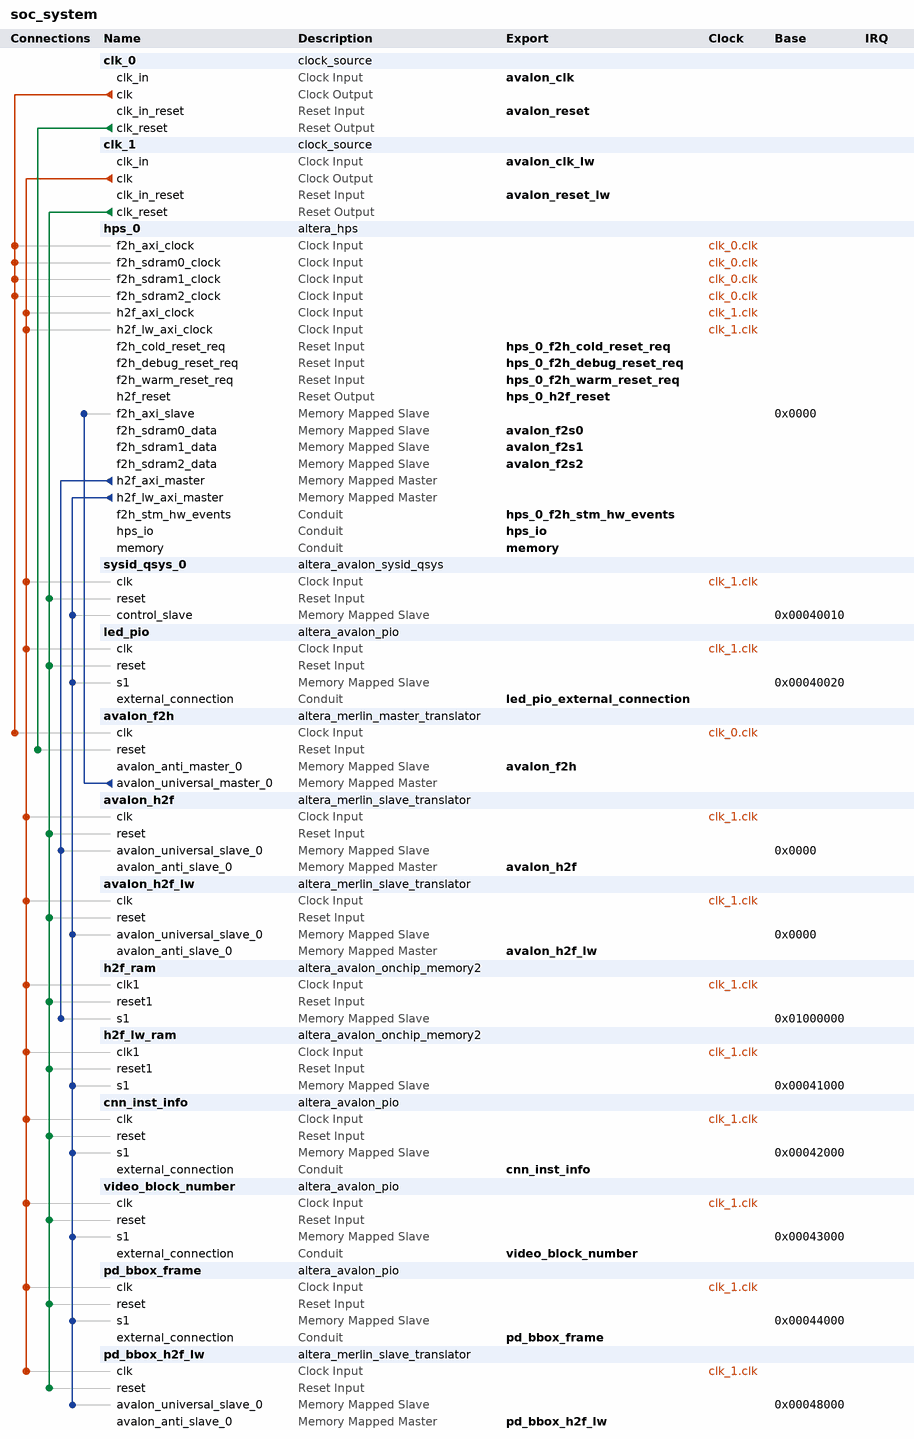
[diagram p0: system contents]
# Platform Designer (Qsys) system soc_system, Cyclone V 5CSEBA6U23I7
# Parameters at their usual value, and those the tool derives, are not listed.
package require -exact qsys 14.0
create_system soc_system
set_project_property DEVICE_FAMILY {Cyclone V}
set_project_property DEVICE 5CSEBA6U23I7

add_instance clk_0 clock_source 14.0
set_instance_parameter_value clk_0 clockFrequency 150000000

add_instance clk_1 clock_source 14.0
set_instance_parameter_value clk_1 clockFrequency 50000000

add_instance hps_0 altera_hps 14.0
set_instance_parameter_value hps_0 MEM_VENDOR Other
set_instance_parameter_value hps_0 MEM_ROW_ADDR_WIDTH 15
set_instance_parameter_value hps_0 MEM_COL_ADDR_WIDTH 10
set_instance_parameter_value hps_0 MEM_DQ_WIDTH 32
set_instance_parameter_value hps_0 MEM_BANKADDR_WIDTH 3
set_instance_parameter_value hps_0 MEM_DRV_STR RZQ/6
set_instance_parameter_value hps_0 MEM_RTT_NOM RZQ/6
set_instance_parameter_value hps_0 MEM_RTT_WR {Dynamic ODT off}
set_instance_parameter_value hps_0 MEM_WTCL 7
set_instance_parameter_value hps_0 MEM_TCL 7
set_instance_parameter_value hps_0 TIMING_TIS 175
set_instance_parameter_value hps_0 TIMING_TIH 250
set_instance_parameter_value hps_0 TIMING_TDS 50
set_instance_parameter_value hps_0 TIMING_TDH 125
set_instance_parameter_value hps_0 TIMING_TDQSQ 120
set_instance_parameter_value hps_0 TIMING_TDQSCK 400
set_instance_parameter_value hps_0 TIMING_TQSH 0.38
set_instance_parameter_value hps_0 MEM_TRAS_NS 35.0
set_instance_parameter_value hps_0 MEM_TRCD_NS 13.75
set_instance_parameter_value hps_0 MEM_TRP_NS 13.75
set_instance_parameter_value hps_0 MEM_TRFC_NS 300.0
set_instance_parameter_value hps_0 MEM_TFAW_NS 37.5
set_instance_parameter_value hps_0 REF_CLK_FREQ 25.0
set_instance_parameter_value hps_0 TIMING_BOARD_MAX_CK_DELAY 0.6
set_instance_parameter_value hps_0 TIMING_BOARD_MAX_DQS_DELAY 0.6
set_instance_parameter_value hps_0 TIMING_BOARD_SKEW_CKDQS_DIMM_MIN -0.01
set_instance_parameter_value hps_0 TIMING_BOARD_SKEW_CKDQS_DIMM_MAX 0.01
set_instance_parameter_value hps_0 TIMING_BOARD_SKEW_WITHIN_DQS 0.02
set_instance_parameter_value hps_0 TIMING_BOARD_SKEW_BETWEEN_DQS 0.02
set_instance_parameter_value hps_0 TIMING_BOARD_DQ_TO_DQS_SKEW 0.0
set_instance_parameter_value hps_0 TIMING_BOARD_AC_SKEW 0.02
set_instance_parameter_value hps_0 TIMING_BOARD_AC_TO_CK_SKEW 0.0
set_instance_parameter_value hps_0 MEM_CLK_FREQ 400.0
set_instance_parameter_value hps_0 HPS_PROTOCOL DDR3
set_instance_parameter_value hps_0 desired_cfg_clk_mhz 100.0
set_instance_parameter_value hps_0 desired_qspi_clk_mhz 400.0
set_instance_parameter_value hps_0 STM_Enable true
set_instance_parameter_value hps_0 F2S_Width 1
set_instance_parameter_value hps_0 S2F_Width 1
set_instance_parameter_value hps_0 LWH2F_Enable true
set_instance_parameter_value hps_0 F2SDRAM_Type {Avalon-MM Bidirectional,Avalon-MM Bidirectional,Avalon-MM Bidirectional}
set_instance_parameter_value hps_0 F2SDRAM_Width 32,32,32
set_instance_parameter_value hps_0 F2SCLK_DBGRST_Enable true
set_instance_parameter_value hps_0 F2SCLK_WARMRST_Enable true
set_instance_parameter_value hps_0 F2SCLK_COLDRST_Enable true
set_instance_parameter_value hps_0 F2SINTERRUPT_Enable false
set_instance_parameter_value hps_0 EMAC1_PinMuxing {HPS I/O Set 0}
set_instance_parameter_value hps_0 EMAC1_Mode RGMII
set_instance_parameter_value hps_0 QSPI_PinMuxing Unused
set_instance_parameter_value hps_0 QSPI_Mode N/A
set_instance_parameter_value hps_0 SDIO_PinMuxing {HPS I/O Set 0}
set_instance_parameter_value hps_0 SDIO_Mode {4-bit Data}
set_instance_parameter_value hps_0 USB1_PinMuxing {HPS I/O Set 0}
set_instance_parameter_value hps_0 USB1_Mode SDR
set_instance_parameter_value hps_0 SPIM1_PinMuxing {HPS I/O Set 0}
set_instance_parameter_value hps_0 SPIM1_Mode {Single Slave Select}
set_instance_parameter_value hps_0 UART0_PinMuxing {HPS I/O Set 0}
set_instance_parameter_value hps_0 UART0_Mode {No Flow Control}
set_instance_parameter_value hps_0 I2C0_PinMuxing {HPS I/O Set 0}
set_instance_parameter_value hps_0 I2C0_Mode I2C
set_instance_parameter_value hps_0 I2C1_PinMuxing {HPS I/O Set 0}
set_instance_parameter_value hps_0 I2C1_Mode I2C
set_instance_parameter_value hps_0 FPGA_PERIPHERAL_OUTPUT_CLOCK_FREQ_EMAC0_MD_CLK 100
set_instance_parameter_value hps_0 FPGA_PERIPHERAL_OUTPUT_CLOCK_FREQ_EMAC0_GTX_CLK 100
set_instance_parameter_value hps_0 FPGA_PERIPHERAL_OUTPUT_CLOCK_FREQ_EMAC1_MD_CLK 100
set_instance_parameter_value hps_0 FPGA_PERIPHERAL_OUTPUT_CLOCK_FREQ_EMAC1_GTX_CLK 100

add_instance sysid_qsys_0 altera_avalon_sysid_qsys 14.0
set_instance_parameter_value sysid_qsys_0 id 305419896

add_instance led_pio altera_avalon_pio 14.0
set_instance_parameter_value led_pio direction Output
set_instance_parameter_value led_pio width 8

add_instance avalon_f2h altera_merlin_master_translator 14.0
set_instance_parameter_value avalon_f2h AV_ADDRESS_W 32
set_instance_parameter_value avalon_f2h AV_DATA_W 32
set_instance_parameter_value avalon_f2h AV_BURSTCOUNT_W 4
set_instance_parameter_value avalon_f2h AV_BYTEENABLE_W 4
set_instance_parameter_value avalon_f2h UAV_ADDRESS_W 32
set_instance_parameter_value avalon_f2h UAV_BURSTCOUNT_W 4
set_instance_parameter_value avalon_f2h AV_READLATENCY 0
set_instance_parameter_value avalon_f2h AV_WRITE_WAIT 0
set_instance_parameter_value avalon_f2h AV_READ_WAIT 0
set_instance_parameter_value avalon_f2h AV_DATA_HOLD 0
set_instance_parameter_value avalon_f2h AV_SETUP_WAIT 0
set_instance_parameter_value avalon_f2h USE_READDATA 1
set_instance_parameter_value avalon_f2h USE_WRITEDATA 1
set_instance_parameter_value avalon_f2h USE_READ 1
set_instance_parameter_value avalon_f2h USE_WRITE 1
set_instance_parameter_value avalon_f2h USE_BEGINBURSTTRANSFER 1
set_instance_parameter_value avalon_f2h USE_BEGINTRANSFER 1
set_instance_parameter_value avalon_f2h USE_BYTEENABLE 1
set_instance_parameter_value avalon_f2h USE_CHIPSELECT 0
set_instance_parameter_value avalon_f2h USE_ADDRESS 1
set_instance_parameter_value avalon_f2h USE_BURSTCOUNT 1
set_instance_parameter_value avalon_f2h USE_DEBUGACCESS 0
set_instance_parameter_value avalon_f2h USE_CLKEN 0
set_instance_parameter_value avalon_f2h USE_READDATAVALID 1
set_instance_parameter_value avalon_f2h USE_WAITREQUEST 1
set_instance_parameter_value avalon_f2h USE_LOCK 0
set_instance_parameter_value avalon_f2h USE_READRESPONSE 0
set_instance_parameter_value avalon_f2h USE_WRITERESPONSE 0
set_instance_parameter_value avalon_f2h AV_SYMBOLS_PER_WORD 4
set_instance_parameter_value avalon_f2h AV_ADDRESS_SYMBOLS 0
set_instance_parameter_value avalon_f2h AV_BURSTCOUNT_SYMBOLS 0
set_instance_parameter_value avalon_f2h AV_CONSTANT_BURST_BEHAVIOR 0
set_instance_parameter_value avalon_f2h UAV_CONSTANT_BURST_BEHAVIOR 0
set_instance_parameter_value avalon_f2h AV_LINEWRAPBURSTS 0
set_instance_parameter_value avalon_f2h AV_MAX_PENDING_READ_TRANSACTIONS 64
set_instance_parameter_value avalon_f2h AV_BURSTBOUNDARIES 0
set_instance_parameter_value avalon_f2h AV_INTERLEAVEBURSTS 0
set_instance_parameter_value avalon_f2h AV_BITS_PER_SYMBOL 8
set_instance_parameter_value avalon_f2h AV_ISBIGENDIAN 0
set_instance_parameter_value avalon_f2h AV_ADDRESSGROUP 0
set_instance_parameter_value avalon_f2h UAV_ADDRESSGROUP 0
set_instance_parameter_value avalon_f2h AV_REGISTEROUTGOINGSIGNALS 0
set_instance_parameter_value avalon_f2h AV_REGISTERINCOMINGSIGNALS 0
set_instance_parameter_value avalon_f2h AV_ALWAYSBURSTMAXBURST 1

add_instance avalon_h2f altera_merlin_slave_translator 14.0
set_instance_parameter_value avalon_h2f AV_ADDRESS_W 22
set_instance_parameter_value avalon_h2f AV_DATA_W 32
set_instance_parameter_value avalon_h2f UAV_DATA_W 32
set_instance_parameter_value avalon_h2f AV_BURSTCOUNT_W 4
set_instance_parameter_value avalon_h2f AV_BYTEENABLE_W 4
set_instance_parameter_value avalon_h2f UAV_BYTEENABLE_W 4
set_instance_parameter_value avalon_h2f UAV_ADDRESS_W 22
set_instance_parameter_value avalon_h2f UAV_BURSTCOUNT_W 4
set_instance_parameter_value avalon_h2f AV_READLATENCY 0
set_instance_parameter_value avalon_h2f AV_SETUP_WAIT 0
set_instance_parameter_value avalon_h2f AV_WRITE_WAIT 0
set_instance_parameter_value avalon_h2f AV_READ_WAIT 1
set_instance_parameter_value avalon_h2f AV_DATA_HOLD 0
set_instance_parameter_value avalon_h2f AV_TIMING_UNITS 1
set_instance_parameter_value avalon_h2f USE_READDATA 1
set_instance_parameter_value avalon_h2f USE_WRITEDATA 1
set_instance_parameter_value avalon_h2f USE_READ 1
set_instance_parameter_value avalon_h2f USE_WRITE 1
set_instance_parameter_value avalon_h2f USE_BEGINBURSTTRANSFER 1
set_instance_parameter_value avalon_h2f USE_BEGINTRANSFER 1
set_instance_parameter_value avalon_h2f USE_BYTEENABLE 1
set_instance_parameter_value avalon_h2f USE_CHIPSELECT 0
set_instance_parameter_value avalon_h2f USE_ADDRESS 1
set_instance_parameter_value avalon_h2f USE_BURSTCOUNT 1
set_instance_parameter_value avalon_h2f USE_READDATAVALID 1
set_instance_parameter_value avalon_h2f USE_WAITREQUEST 1
set_instance_parameter_value avalon_h2f USE_WRITEBYTEENABLE 0
set_instance_parameter_value avalon_h2f USE_LOCK 0
set_instance_parameter_value avalon_h2f USE_AV_CLKEN 0
set_instance_parameter_value avalon_h2f USE_UAV_CLKEN 0
set_instance_parameter_value avalon_h2f USE_OUTPUTENABLE 0
set_instance_parameter_value avalon_h2f USE_DEBUGACCESS 0
set_instance_parameter_value avalon_h2f USE_READRESPONSE 0
set_instance_parameter_value avalon_h2f USE_WRITERESPONSE 0
set_instance_parameter_value avalon_h2f AV_SYMBOLS_PER_WORD 4
set_instance_parameter_value avalon_h2f AV_ADDRESS_SYMBOLS 0
set_instance_parameter_value avalon_h2f AV_BURSTCOUNT_SYMBOLS 0
set_instance_parameter_value avalon_h2f AV_CONSTANT_BURST_BEHAVIOR 0
set_instance_parameter_value avalon_h2f UAV_CONSTANT_BURST_BEHAVIOR 0
set_instance_parameter_value avalon_h2f AV_REQUIRE_UNALIGNED_ADDRESSES 0
set_instance_parameter_value avalon_h2f AV_LINEWRAPBURSTS 0
set_instance_parameter_value avalon_h2f AV_MAX_PENDING_READ_TRANSACTIONS 64
set_instance_parameter_value avalon_h2f AV_MAX_PENDING_WRITE_TRANSACTIONS 0
set_instance_parameter_value avalon_h2f AV_BURSTBOUNDARIES 0
set_instance_parameter_value avalon_h2f AV_INTERLEAVEBURSTS 0
set_instance_parameter_value avalon_h2f AV_BITS_PER_SYMBOL 8
set_instance_parameter_value avalon_h2f AV_ISBIGENDIAN 0
set_instance_parameter_value avalon_h2f AV_ADDRESSGROUP 0
set_instance_parameter_value avalon_h2f UAV_ADDRESSGROUP 0
set_instance_parameter_value avalon_h2f AV_REGISTEROUTGOINGSIGNALS 0
set_instance_parameter_value avalon_h2f AV_REGISTERINCOMINGSIGNALS 0
set_instance_parameter_value avalon_h2f AV_ALWAYSBURSTMAXBURST 1
set_instance_parameter_value avalon_h2f CHIPSELECT_THROUGH_READLATENCY 0
set_instance_parameter_value avalon_h2f CLOCK_RATE 50000000

add_instance avalon_h2f_lw altera_merlin_slave_translator 14.0
set_instance_parameter_value avalon_h2f_lw AV_ADDRESS_W 16
set_instance_parameter_value avalon_h2f_lw AV_DATA_W 32
set_instance_parameter_value avalon_h2f_lw UAV_DATA_W 32
set_instance_parameter_value avalon_h2f_lw AV_BURSTCOUNT_W 4
set_instance_parameter_value avalon_h2f_lw AV_BYTEENABLE_W 4
set_instance_parameter_value avalon_h2f_lw UAV_BYTEENABLE_W 4
set_instance_parameter_value avalon_h2f_lw UAV_ADDRESS_W 16
set_instance_parameter_value avalon_h2f_lw UAV_BURSTCOUNT_W 4
set_instance_parameter_value avalon_h2f_lw AV_READLATENCY 0
set_instance_parameter_value avalon_h2f_lw AV_SETUP_WAIT 0
set_instance_parameter_value avalon_h2f_lw AV_WRITE_WAIT 0
set_instance_parameter_value avalon_h2f_lw AV_READ_WAIT 1
set_instance_parameter_value avalon_h2f_lw AV_DATA_HOLD 0
set_instance_parameter_value avalon_h2f_lw AV_TIMING_UNITS 1
set_instance_parameter_value avalon_h2f_lw USE_READDATA 1
set_instance_parameter_value avalon_h2f_lw USE_WRITEDATA 1
set_instance_parameter_value avalon_h2f_lw USE_READ 1
set_instance_parameter_value avalon_h2f_lw USE_WRITE 1
set_instance_parameter_value avalon_h2f_lw USE_BEGINBURSTTRANSFER 1
set_instance_parameter_value avalon_h2f_lw USE_BEGINTRANSFER 1
set_instance_parameter_value avalon_h2f_lw USE_BYTEENABLE 1
set_instance_parameter_value avalon_h2f_lw USE_CHIPSELECT 0
set_instance_parameter_value avalon_h2f_lw USE_ADDRESS 1
set_instance_parameter_value avalon_h2f_lw USE_BURSTCOUNT 1
set_instance_parameter_value avalon_h2f_lw USE_READDATAVALID 1
set_instance_parameter_value avalon_h2f_lw USE_WAITREQUEST 1
set_instance_parameter_value avalon_h2f_lw USE_WRITEBYTEENABLE 0
set_instance_parameter_value avalon_h2f_lw USE_LOCK 0
set_instance_parameter_value avalon_h2f_lw USE_AV_CLKEN 0
set_instance_parameter_value avalon_h2f_lw USE_UAV_CLKEN 0
set_instance_parameter_value avalon_h2f_lw USE_OUTPUTENABLE 0
set_instance_parameter_value avalon_h2f_lw USE_DEBUGACCESS 0
set_instance_parameter_value avalon_h2f_lw USE_READRESPONSE 0
set_instance_parameter_value avalon_h2f_lw USE_WRITERESPONSE 0
set_instance_parameter_value avalon_h2f_lw AV_SYMBOLS_PER_WORD 4
set_instance_parameter_value avalon_h2f_lw AV_ADDRESS_SYMBOLS 0
set_instance_parameter_value avalon_h2f_lw AV_BURSTCOUNT_SYMBOLS 0
set_instance_parameter_value avalon_h2f_lw AV_CONSTANT_BURST_BEHAVIOR 0
set_instance_parameter_value avalon_h2f_lw UAV_CONSTANT_BURST_BEHAVIOR 0
set_instance_parameter_value avalon_h2f_lw AV_REQUIRE_UNALIGNED_ADDRESSES 0
set_instance_parameter_value avalon_h2f_lw AV_LINEWRAPBURSTS 0
set_instance_parameter_value avalon_h2f_lw AV_MAX_PENDING_READ_TRANSACTIONS 64
set_instance_parameter_value avalon_h2f_lw AV_MAX_PENDING_WRITE_TRANSACTIONS 0
set_instance_parameter_value avalon_h2f_lw AV_BURSTBOUNDARIES 0
set_instance_parameter_value avalon_h2f_lw AV_INTERLEAVEBURSTS 0
set_instance_parameter_value avalon_h2f_lw AV_BITS_PER_SYMBOL 8
set_instance_parameter_value avalon_h2f_lw AV_ISBIGENDIAN 0
set_instance_parameter_value avalon_h2f_lw AV_ADDRESSGROUP 0
set_instance_parameter_value avalon_h2f_lw UAV_ADDRESSGROUP 0
set_instance_parameter_value avalon_h2f_lw AV_REGISTEROUTGOINGSIGNALS 0
set_instance_parameter_value avalon_h2f_lw AV_REGISTERINCOMINGSIGNALS 0
set_instance_parameter_value avalon_h2f_lw AV_ALWAYSBURSTMAXBURST 1
set_instance_parameter_value avalon_h2f_lw CHIPSELECT_THROUGH_READLATENCY 0
set_instance_parameter_value avalon_h2f_lw CLOCK_RATE 50000000

add_instance h2f_ram altera_avalon_onchip_memory2 14.0
set_instance_parameter_value h2f_ram allowInSystemMemoryContentEditor true
set_instance_parameter_value h2f_ram dataWidth 128
set_instance_parameter_value h2f_ram dualPort false
set_instance_parameter_value h2f_ram initMemContent true
set_instance_parameter_value h2f_ram initializationFileName onchip_mem.hex
set_instance_parameter_value h2f_ram instanceID h2fr
set_instance_parameter_value h2f_ram memorySize 256

add_instance h2f_lw_ram altera_avalon_onchip_memory2 14.0
set_instance_parameter_value h2f_lw_ram allowInSystemMemoryContentEditor true
set_instance_parameter_value h2f_lw_ram dataWidth 32
set_instance_parameter_value h2f_lw_ram dualPort false
set_instance_parameter_value h2f_lw_ram initMemContent true
set_instance_parameter_value h2f_lw_ram initializationFileName onchip_mem.hex
set_instance_parameter_value h2f_lw_ram instanceID lwrm
set_instance_parameter_value h2f_lw_ram memorySize 16

add_instance cnn_inst_info altera_avalon_pio 14.0
set_instance_parameter_value cnn_inst_info direction Input
set_instance_parameter_value cnn_inst_info width 32

add_instance video_block_number altera_avalon_pio 14.0
set_instance_parameter_value video_block_number direction Input
set_instance_parameter_value video_block_number width 32

add_instance pd_bbox_frame altera_avalon_pio 14.0
set_instance_parameter_value pd_bbox_frame direction Output
set_instance_parameter_value pd_bbox_frame width 8

add_instance pd_bbox_h2f_lw altera_merlin_slave_translator 14.0
set_instance_parameter_value pd_bbox_h2f_lw AV_ADDRESS_W 12
set_instance_parameter_value pd_bbox_h2f_lw AV_DATA_W 32
set_instance_parameter_value pd_bbox_h2f_lw UAV_DATA_W 32
set_instance_parameter_value pd_bbox_h2f_lw AV_BURSTCOUNT_W 4
set_instance_parameter_value pd_bbox_h2f_lw AV_BYTEENABLE_W 4
set_instance_parameter_value pd_bbox_h2f_lw UAV_BYTEENABLE_W 4
set_instance_parameter_value pd_bbox_h2f_lw UAV_ADDRESS_W 12
set_instance_parameter_value pd_bbox_h2f_lw UAV_BURSTCOUNT_W 4
set_instance_parameter_value pd_bbox_h2f_lw AV_READLATENCY 0
set_instance_parameter_value pd_bbox_h2f_lw AV_SETUP_WAIT 0
set_instance_parameter_value pd_bbox_h2f_lw AV_WRITE_WAIT 0
set_instance_parameter_value pd_bbox_h2f_lw AV_READ_WAIT 1
set_instance_parameter_value pd_bbox_h2f_lw AV_DATA_HOLD 0
set_instance_parameter_value pd_bbox_h2f_lw AV_TIMING_UNITS 1
set_instance_parameter_value pd_bbox_h2f_lw USE_READDATA 1
set_instance_parameter_value pd_bbox_h2f_lw USE_WRITEDATA 1
set_instance_parameter_value pd_bbox_h2f_lw USE_READ 1
set_instance_parameter_value pd_bbox_h2f_lw USE_WRITE 1
set_instance_parameter_value pd_bbox_h2f_lw USE_BEGINBURSTTRANSFER 1
set_instance_parameter_value pd_bbox_h2f_lw USE_BEGINTRANSFER 1
set_instance_parameter_value pd_bbox_h2f_lw USE_BYTEENABLE 1
set_instance_parameter_value pd_bbox_h2f_lw USE_CHIPSELECT 0
set_instance_parameter_value pd_bbox_h2f_lw USE_ADDRESS 1
set_instance_parameter_value pd_bbox_h2f_lw USE_BURSTCOUNT 1
set_instance_parameter_value pd_bbox_h2f_lw USE_READDATAVALID 1
set_instance_parameter_value pd_bbox_h2f_lw USE_WAITREQUEST 1
set_instance_parameter_value pd_bbox_h2f_lw USE_WRITEBYTEENABLE 0
set_instance_parameter_value pd_bbox_h2f_lw USE_LOCK 0
set_instance_parameter_value pd_bbox_h2f_lw USE_AV_CLKEN 0
set_instance_parameter_value pd_bbox_h2f_lw USE_UAV_CLKEN 0
set_instance_parameter_value pd_bbox_h2f_lw USE_OUTPUTENABLE 0
set_instance_parameter_value pd_bbox_h2f_lw USE_DEBUGACCESS 0
set_instance_parameter_value pd_bbox_h2f_lw USE_READRESPONSE 0
set_instance_parameter_value pd_bbox_h2f_lw USE_WRITERESPONSE 0
set_instance_parameter_value pd_bbox_h2f_lw AV_SYMBOLS_PER_WORD 4
set_instance_parameter_value pd_bbox_h2f_lw AV_ADDRESS_SYMBOLS 0
set_instance_parameter_value pd_bbox_h2f_lw AV_BURSTCOUNT_SYMBOLS 0
set_instance_parameter_value pd_bbox_h2f_lw AV_CONSTANT_BURST_BEHAVIOR 0
set_instance_parameter_value pd_bbox_h2f_lw UAV_CONSTANT_BURST_BEHAVIOR 0
set_instance_parameter_value pd_bbox_h2f_lw AV_REQUIRE_UNALIGNED_ADDRESSES 0
set_instance_parameter_value pd_bbox_h2f_lw AV_LINEWRAPBURSTS 0
set_instance_parameter_value pd_bbox_h2f_lw AV_MAX_PENDING_READ_TRANSACTIONS 64
set_instance_parameter_value pd_bbox_h2f_lw AV_MAX_PENDING_WRITE_TRANSACTIONS 0
set_instance_parameter_value pd_bbox_h2f_lw AV_BURSTBOUNDARIES 0
set_instance_parameter_value pd_bbox_h2f_lw AV_INTERLEAVEBURSTS 0
set_instance_parameter_value pd_bbox_h2f_lw AV_BITS_PER_SYMBOL 8
set_instance_parameter_value pd_bbox_h2f_lw AV_ISBIGENDIAN 0
set_instance_parameter_value pd_bbox_h2f_lw AV_ADDRESSGROUP 0
set_instance_parameter_value pd_bbox_h2f_lw UAV_ADDRESSGROUP 0
set_instance_parameter_value pd_bbox_h2f_lw AV_REGISTEROUTGOINGSIGNALS 0
set_instance_parameter_value pd_bbox_h2f_lw AV_REGISTERINCOMINGSIGNALS 0
set_instance_parameter_value pd_bbox_h2f_lw AV_ALWAYSBURSTMAXBURST 0
set_instance_parameter_value pd_bbox_h2f_lw CHIPSELECT_THROUGH_READLATENCY 0
set_instance_parameter_value pd_bbox_h2f_lw CLOCK_RATE 50000000

# connections
add_connection clk_0.clk avalon_f2h.clk clock
add_connection clk_0.clk hps_0.f2h_axi_clock clock
add_connection clk_0.clk hps_0.f2h_sdram0_clock clock
add_connection clk_0.clk hps_0.f2h_sdram1_clock clock
add_connection clk_0.clk hps_0.f2h_sdram2_clock clock
add_connection clk_1.clk avalon_h2f.clk clock
add_connection clk_1.clk avalon_h2f_lw.clk clock
add_connection clk_1.clk cnn_inst_info.clk clock
add_connection clk_1.clk h2f_lw_ram.clk1 clock
add_connection clk_1.clk h2f_ram.clk1 clock
add_connection clk_1.clk hps_0.h2f_axi_clock clock
add_connection clk_1.clk hps_0.h2f_lw_axi_clock clock
add_connection clk_1.clk led_pio.clk clock
add_connection clk_1.clk pd_bbox_frame.clk clock
add_connection clk_1.clk pd_bbox_h2f_lw.clk clock
add_connection clk_1.clk sysid_qsys_0.clk clock
add_connection clk_1.clk video_block_number.clk clock
add_connection clk_0.clk_reset avalon_f2h.reset reset
add_connection clk_1.clk_reset avalon_h2f.reset reset
add_connection clk_1.clk_reset avalon_h2f_lw.reset reset
add_connection clk_1.clk_reset cnn_inst_info.reset reset
add_connection clk_1.clk_reset h2f_lw_ram.reset1 reset
add_connection clk_1.clk_reset h2f_ram.reset1 reset
add_connection clk_1.clk_reset led_pio.reset reset
add_connection clk_1.clk_reset pd_bbox_frame.reset reset
add_connection clk_1.clk_reset pd_bbox_h2f_lw.reset reset
add_connection clk_1.clk_reset sysid_qsys_0.reset reset
add_connection clk_1.clk_reset video_block_number.reset reset
add_connection avalon_f2h.avalon_universal_master_0 hps_0.f2h_axi_slave avalon
set_connection_parameter_value avalon_f2h.avalon_universal_master_0/hps_0.f2h_axi_slave baseAddress 0x0000
add_connection hps_0.h2f_axi_master avalon_h2f.avalon_universal_slave_0 avalon
set_connection_parameter_value hps_0.h2f_axi_master/avalon_h2f.avalon_universal_slave_0 baseAddress 0x0000
add_connection hps_0.h2f_axi_master h2f_ram.s1 avalon
set_connection_parameter_value hps_0.h2f_axi_master/h2f_ram.s1 baseAddress 0x01000000
add_connection hps_0.h2f_lw_axi_master avalon_h2f_lw.avalon_universal_slave_0 avalon
set_connection_parameter_value hps_0.h2f_lw_axi_master/avalon_h2f_lw.avalon_universal_slave_0 baseAddress 0x0000
add_connection hps_0.h2f_lw_axi_master cnn_inst_info.s1 avalon
set_connection_parameter_value hps_0.h2f_lw_axi_master/cnn_inst_info.s1 baseAddress 0x00042000
add_connection hps_0.h2f_lw_axi_master h2f_lw_ram.s1 avalon
set_connection_parameter_value hps_0.h2f_lw_axi_master/h2f_lw_ram.s1 baseAddress 0x00041000
add_connection hps_0.h2f_lw_axi_master led_pio.s1 avalon
set_connection_parameter_value hps_0.h2f_lw_axi_master/led_pio.s1 baseAddress 0x00040020
add_connection hps_0.h2f_lw_axi_master pd_bbox_frame.s1 avalon
set_connection_parameter_value hps_0.h2f_lw_axi_master/pd_bbox_frame.s1 baseAddress 0x00044000
add_connection hps_0.h2f_lw_axi_master pd_bbox_h2f_lw.avalon_universal_slave_0 avalon
set_connection_parameter_value hps_0.h2f_lw_axi_master/pd_bbox_h2f_lw.avalon_universal_slave_0 baseAddress 0x00048000
add_connection hps_0.h2f_lw_axi_master sysid_qsys_0.control_slave avalon
set_connection_parameter_value hps_0.h2f_lw_axi_master/sysid_qsys_0.control_slave baseAddress 0x00040010
add_connection hps_0.h2f_lw_axi_master video_block_number.s1 avalon
set_connection_parameter_value hps_0.h2f_lw_axi_master/video_block_number.s1 baseAddress 0x00043000

# exported interfaces
add_interface avalon_clk clock sink
set_interface_property avalon_clk EXPORT_OF clk_0.clk_in
add_interface avalon_reset reset sink
set_interface_property avalon_reset EXPORT_OF clk_0.clk_in_reset
add_interface avalon_clk_lw clock sink
set_interface_property avalon_clk_lw EXPORT_OF clk_1.clk_in
add_interface avalon_reset_lw reset sink
set_interface_property avalon_reset_lw EXPORT_OF clk_1.clk_in_reset
add_interface memory conduit end
set_interface_property memory EXPORT_OF hps_0.memory
add_interface hps_io conduit end
set_interface_property hps_io EXPORT_OF hps_0.hps_io
add_interface hps_0_f2h_cold_reset_req reset sink
set_interface_property hps_0_f2h_cold_reset_req EXPORT_OF hps_0.f2h_cold_reset_req
add_interface hps_0_f2h_debug_reset_req reset sink
set_interface_property hps_0_f2h_debug_reset_req EXPORT_OF hps_0.f2h_debug_reset_req
add_interface hps_0_f2h_stm_hw_events conduit end
set_interface_property hps_0_f2h_stm_hw_events EXPORT_OF hps_0.f2h_stm_hw_events
add_interface hps_0_f2h_warm_reset_req reset sink
set_interface_property hps_0_f2h_warm_reset_req EXPORT_OF hps_0.f2h_warm_reset_req
add_interface hps_0_h2f_reset reset source
set_interface_property hps_0_h2f_reset EXPORT_OF hps_0.h2f_reset
add_interface avalon_f2s0 avalon slave
set_interface_property avalon_f2s0 EXPORT_OF hps_0.f2h_sdram0_data
add_interface led_pio_external_connection conduit end
set_interface_property led_pio_external_connection EXPORT_OF led_pio.external_connection
add_interface avalon_f2h avalon slave
set_interface_property avalon_f2h EXPORT_OF avalon_f2h.avalon_anti_master_0
add_interface avalon_h2f avalon master
set_interface_property avalon_h2f EXPORT_OF avalon_h2f.avalon_anti_slave_0
add_interface avalon_h2f_lw avalon master
set_interface_property avalon_h2f_lw EXPORT_OF avalon_h2f_lw.avalon_anti_slave_0
add_interface cnn_inst_info conduit end
set_interface_property cnn_inst_info EXPORT_OF cnn_inst_info.external_connection
add_interface video_block_number conduit end
set_interface_property video_block_number EXPORT_OF video_block_number.external_connection
add_interface avalon_f2s1 avalon slave
set_interface_property avalon_f2s1 EXPORT_OF hps_0.f2h_sdram1_data
add_interface pd_bbox_frame conduit end
set_interface_property pd_bbox_frame EXPORT_OF pd_bbox_frame.external_connection
add_interface pd_bbox_h2f_lw avalon master
set_interface_property pd_bbox_h2f_lw EXPORT_OF pd_bbox_h2f_lw.avalon_anti_slave_0
add_interface avalon_f2s2 avalon slave
set_interface_property avalon_f2s2 EXPORT_OF hps_0.f2h_sdram2_data

set_interconnect_requirement {$system} qsys_mm.clockCrossingAdapter HANDSHAKE
set_interconnect_requirement {$system} qsys_mm.maxAdditionalLatency 4
set_interconnect_requirement {$system} qsys_mm.insertDefaultSlave FALSE

save_system soc_system.qsys
